# Altium project 飞控.PrjPCB
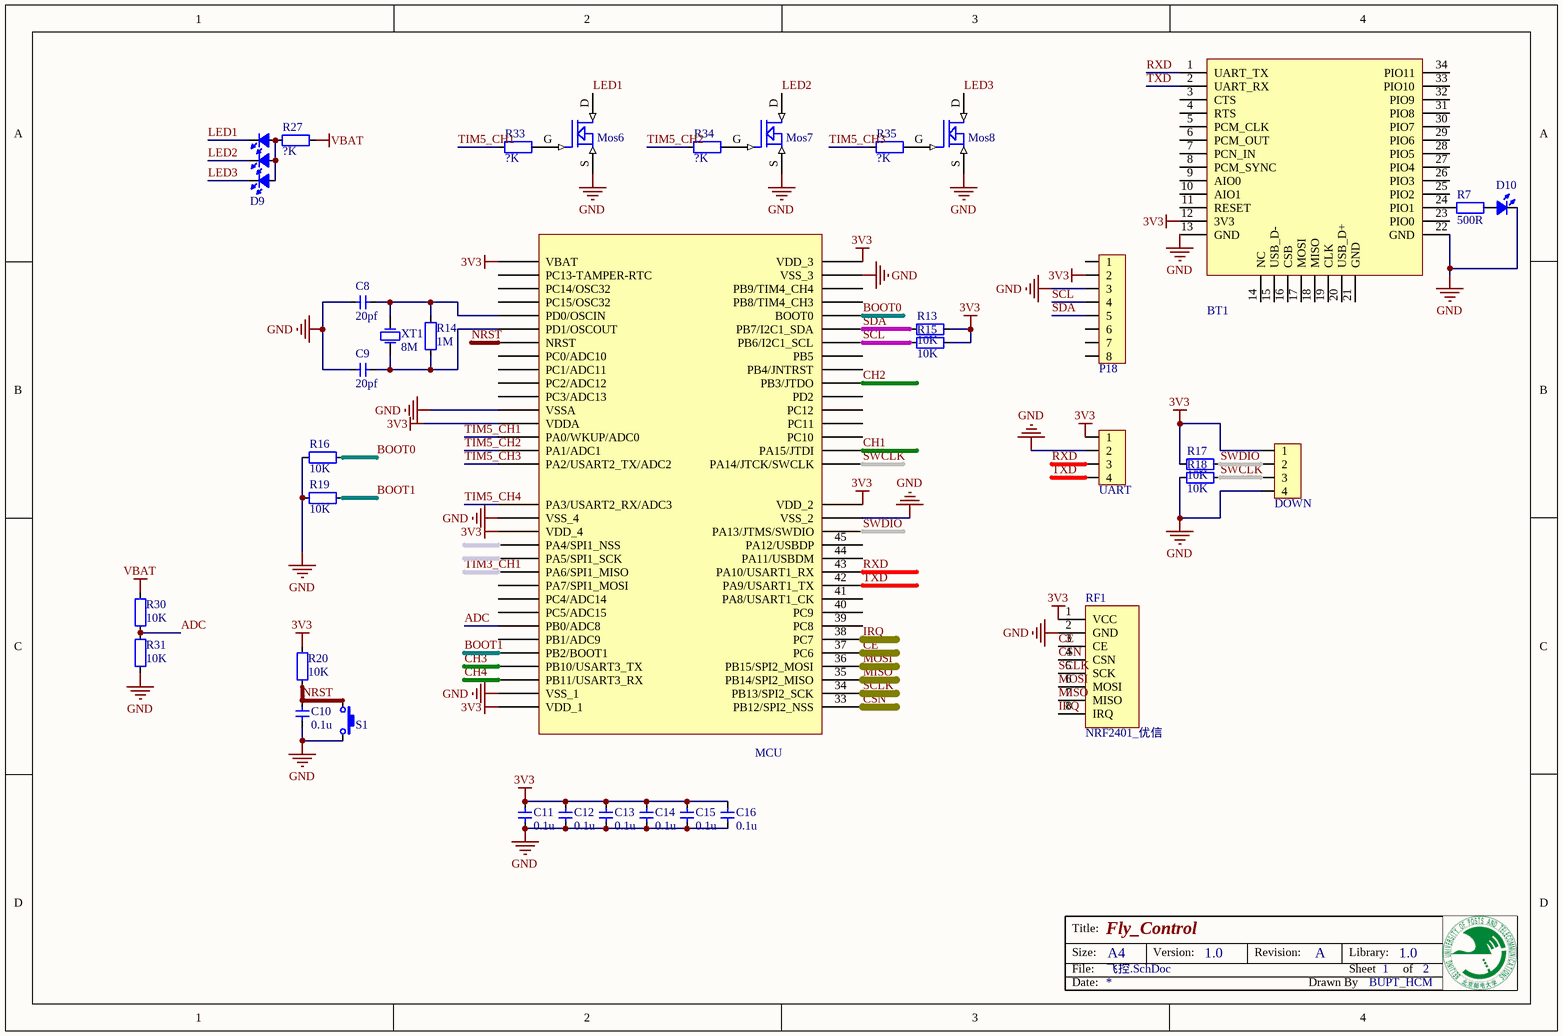
[diagram p0: 飞控.SchDoc]
2 sheets, 90 parts. Net scope: global (net labels, ports and power ports of the same name join across sheets).
Board file: 飞控PCB.PcbDoc
Sheets:
  飞控.SchDoc
  接口.SchDoc

## Sheet 飞控.SchDoc: Fly_Control
size A4; CompanyName: BUPT; DrawnBy: BUPT_HCM; Organization: BUPT_Robot; Revision: A; SheetNumber: 1; SheetTotal: 2; Version: 1.0; LibVersion: 1.0

### Parts
BT1  Bluetooth_HC05  [Bluetooth_HC05]  (value not drawn)
C8  value 20pf  [CAP_0603]  (hidden comment: Cap_0603)
C9  value 20pf  [CAP_0603]  (hidden comment: Cap_0603)
C10  value 0.1u  [CAP_0603]  (hidden comment: Cap_0603)
C11  value 0.1u  [CAP_0603]  (hidden comment: Cap_0603)
C12  value 0.1u  [CAP_0603]  (hidden comment: Cap_0603)
C13  value 0.1u  [CAP_0603]  (hidden comment: Cap_0603)
C14  value 0.1u  [CAP_0603]  (hidden comment: Cap_0603)
C15  value 0.1u  [CAP_0603]  (hidden comment: Cap_0603)
C16  value 0.1u  [CAP_0603]  (hidden comment: Cap_0603)
D9  LED_5050_RGB  [LED_5050_6P]  (value not drawn)
D10  LED_0805  [LED_0805_BLUE]  (value not drawn)
DOWN  HDR1x4_2.54  [HDR1X4_2.54_90]  (value not drawn)
MCU  STM32F103RC  [LQFP_P0.5_64]  (value not drawn)
Mos6  MOSFET N  [Nmos_SOT23]  (value not drawn)
Mos7  MOSFET N  [Nmos_SOT23]  (value not drawn)
Mos8  MOSFET N  [Nmos_SOT23]  (value not drawn)
P18  HDR1x8_2.54  [HDR1X8_2.54_180]  (value not drawn)
R7  value 500R  [RES_0603]  (hidden comment: Res_0603)
R13  value 10K  [RES_0603]  (hidden comment: Res_0603)
R14  value 1M  [RES_0603]  (hidden comment: Res_0603)
R15  value 10K  [RES_0603]  (hidden comment: Res_0603)
R16  value 10K  [RES_0603]  (hidden comment: Res_0603)
R17  value 10K  [RES_0603]  (hidden comment: Res_0603)
R18  value 10K  [RES_0603]  (hidden comment: Res_0603)
R19  value 10K  [RES_0603]  (hidden comment: Res_0603)
R20  value 10K  [RES_0603]  (hidden comment: Res_0603)
R27  value ?K  [RES_0603]  (hidden comment: Res_0603)
R30  value 10K  [RES_0603]  (hidden comment: Res_0603)
R31  value 10K  [RES_0603]  (hidden comment: Res_0603)
R33  value ?K  [RES_0603]  (hidden comment: Res_0603)
R34  value ?K  [RES_0603]  (hidden comment: Res_0603)
R35  value ?K  [RES_0603]  (hidden comment: Res_0603)
RF1  NRF2401_优信  [nrf24l01_youxin]
S1  ButtonTACT_3x4x2_180  [ButtonTACT_3x4x2_180H]  (value not drawn)
UART  HDR1x4_2.54  [HDR1x4_2.54_180]  (value not drawn)
XT1  value 8M  [XT_5032_2]  (hidden comment: XTAL_5032_2P)

### Nets
3V3: BT1.12(3V3) C11.2 C12.2 C13.2 C14.2 C15.2 C16.2 DOWN.1 MCU.1(VBAT) MCU.13(VDDA) MCU.19(VDD_4) MCU.32(VDD_1) MCU.48(VDD_2) MCU.64(VDD_3) P18.2 R13.2 R15.2 R17.2 R20.1 RF1.1(VCC) UART.1
GND: BT1.13(GND) BT1.22(GND) C8.1 C9.1 C10.1 C11.1 C12.1 C13.1 C14.1 C15.1 C16.1 D10.2(K) DOWN.4 MCU.12(VSSA) MCU.18(VSS_4) MCU.31(VSS_1) MCU.47(VSS_2) MCU.63(VSS_3) Mos6.S Mos7.S Mos8.S P18.3 R16.2 R18.2 R19.2 R31.1 RF1.2(GND) S1.2 UART.2
VBAT: R27.1 R30.2
ADC: MCU.26(PB0/ADC8) R30.1 R31.2
BOOT0: MCU.60(BOOT0) R16.1
BOOT1: MCU.28(PB2/BOOT1) R19.1
CE: MCU.37(PC6) RF1.3(CE)
CH1: MCU.50(PA15/JTDI)
CH2: MCU.55(PB3/JTDO)
CH3: MCU.29(PB10/USART3_TX)
CH4: MCU.30(PB11/USART3_RX)
CSN: MCU.33(PB12/SPI2_NSS) RF1.4(CSN)
IRQ: MCU.38(PC7) RF1.8(IRQ)
LED1: D9.3(K) Mos6.D
LED2: D9.2(K) Mos7.D
LED3: D9.1(K) Mos8.D
MISO: MCU.35(PB14/SPI2_MISO) RF1.7(MISO)
MOSI: MCU.36(PB15/SPI2_MOSI) RF1.6(MOSI)
NRST: C10.2 MCU.7(NRST) R20.2 S1.1
RXD: BT1.1(UART_TX) MCU.43(PA10/USART1_RX) UART.3
SCL: MCU.58(PB6/I2C1_SCL) P18.4 R15.1
SCLK: MCU.34(PB13/SPI2_SCK) RF1.5(SCK)
SDA: MCU.59(PB7/I2C1_SDA) P18.5 R13.1
SWCLK: DOWN.3 MCU.49(PA14/JTCK/SWCLK) R18.1
SWDIO: DOWN.2 MCU.46(PA13/JTMS/SWDIO) R17.1
TIM3_CH1: MCU.22(PA6/SPI1_MISO)
TIM5_CH1: MCU.14(PA0/WKUP/ADC0) R33.1
TIM5_CH2: MCU.15(PA1/ADC1) R34.1
TIM5_CH3: MCU.16(PA2/USART2_TX/ADC2) R35.1
TIM5_CH4: MCU.17(PA3/USART2_RX/ADC3)
TXD: BT1.2(UART_RX) MCU.42(PA9/USART1_TX) UART.4
NetBT1_24: BT1.24(PIO1) R7.1
NetC8_2: C8.2 MCU.5(PD0/OSCIN) R14.2 XT1.2(OSC2)
NetC9_2: C9.2 MCU.6(PD1/OSCOUT) R14.1 XT1.1(OSC1)
NetD9_4: D9.4(A) D9.5(A) D9.6(A) R27.2
NetD10_1: D10.1(A) R7.2
NetMos6_G: Mos6.G R33.2
NetMos7_G: Mos7.G R34.2
NetMos8_G: Mos8.G R35.2

Not connected (* = marked no-connect by the designer): BT1 3(CTS) 4(RTS) 5(PCM_CLK) 6(PCM_OUT) 7(PCN_IN) 8(PCM_SYNC) 9(AIO0) 10(AIO1) 11(RESET) 14(NC) 15(USB_D-) 16(CSB) 17(MOSI) 18(MISO) 19(CLK) 20(USB_D+) 21(GND) 23(PIO0) 25(PIO2) 26(PIO3) 27(PIO4) 28(PIO5) 29(PIO6) 30(PIO7) 31(PIO8) 32(PIO9) 33(PIO10) 34(PIO11); MCU 2(PC13-TAMPER-RTC) 3(PC14/OSC32) 4(PC15/OSC32) 8(PC0/ADC10) 9(PC1/ADC11) 10(PC2/ADC12) 11(PC3/ADC13) 20(PA4/SPI1_NSS) 21(PA5/SPI1_SCK) 23(PA7/SPI1_MOSI) 24(PC4/ADC14) 25(PC5/ADC15) 27(PB1/ADC9) 39(PC8) 40(PC9) 41(PA8/USART1_CK) 44(PA11/USBDM) 45(PA12/USBDP) 51(PC10) 52(PC11) 53(PC12) 54(PD2) 56(PB4/JNTRST) 57(PB5) 61(PB8/TIM4_CH3) 62(PB9/TIM4_CH4); P18 1 6 7 8

### Notes on the sheet
- Title:
- Size:
- Date:
- File:
- A4
- Version:
- Revision:
- Drawn By
- Sheet
- Library:
- of

### Library data of the parts
BT1 = Bluetooth_HC05: Module
C8-C16 = Cap_0603: Capacitor
D9 = LED_5050_RGB: LED
D10 = LED_0805: LED
DOWN UART = HDR1x4_2.54: Header
MCU = STM32F103RC: MCU
Mos6-Mos8 = MOSFET N: MOS SOT23
P18 = HDR1x8_2.54: Header
R7 R13-R20 R27 R30 R31 R33-R35 = Res_0603: Resistor
S1 = ButtonTACT_3x4x2_180: Button
XT1 = XTAL_5032_2P: Crystal Oscillator

## Sheet 接口.SchDoc: Template
size A4; CompanyName: BUPT; DrawnBy: BUPT_HCM; Organization: BUPT_Robot; Revision: A; SheetNumber: 1; SheetTotal: 1; Version: 0.0; LibVersion: 0.0
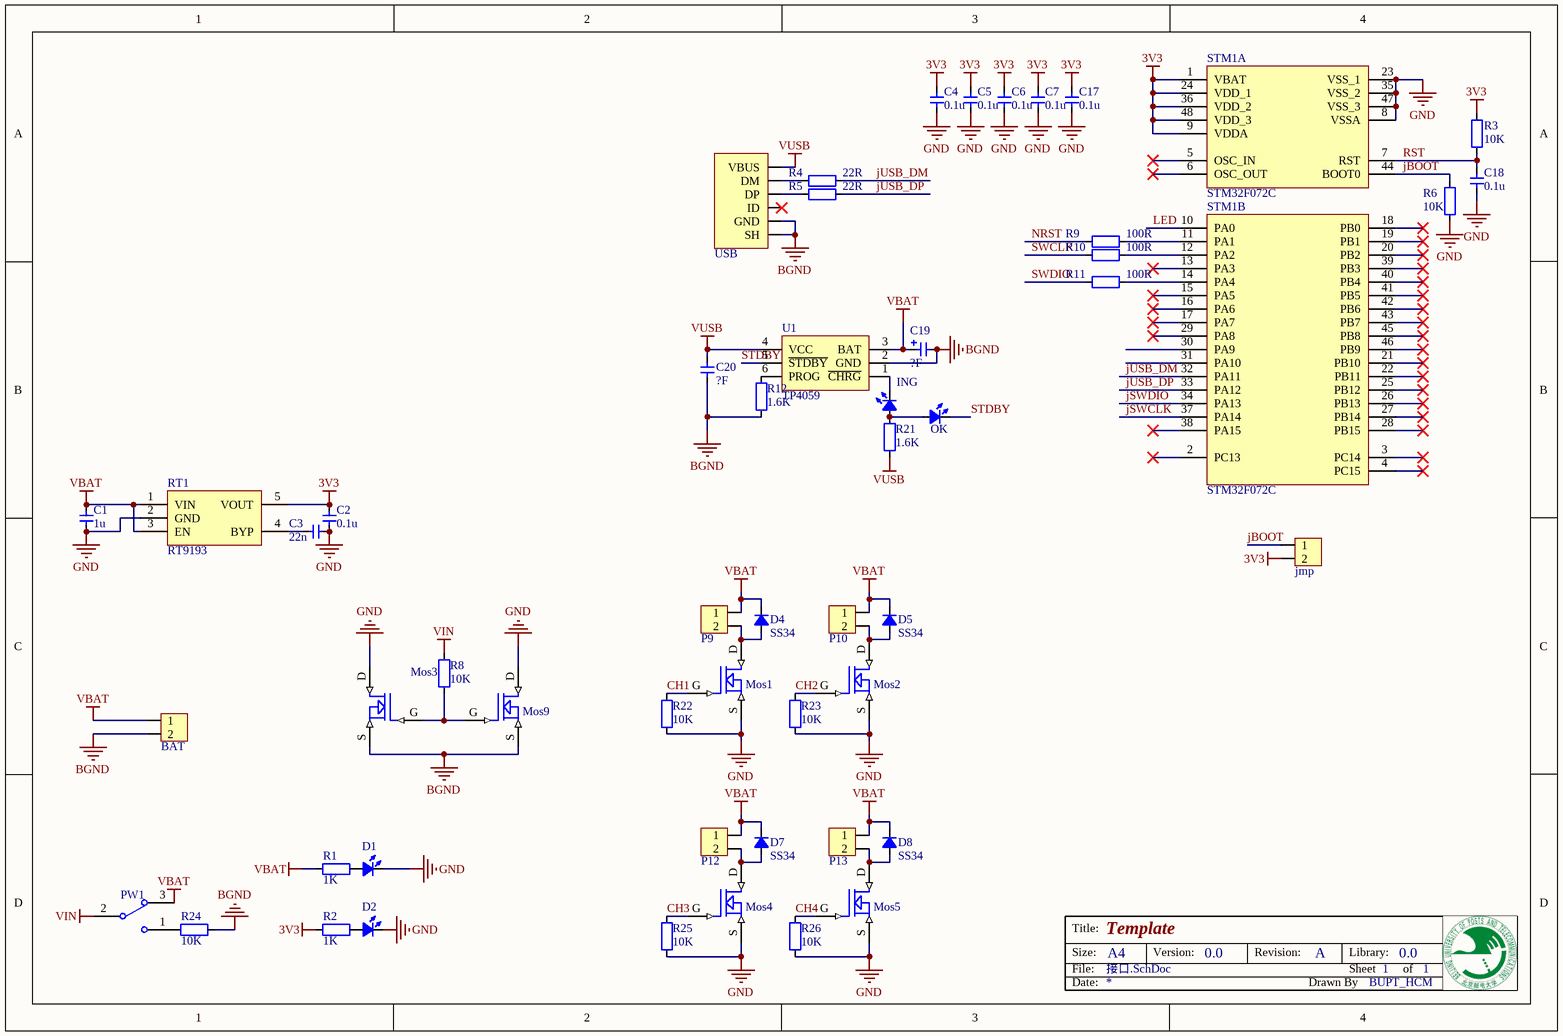
[diagram p1: 接口.SchDoc]

### Parts
BAT  HDR1x2_2.54  [HDR1X2_2.54_90]  (value not drawn)
C1  value 1u  [CAP_0603]  (hidden comment: Cap_0603)
C2  value 0.1u  [CAP_0603]  (hidden comment: Cap_0603)
C3  value 22n  [CAP_0603]  (hidden comment: Cap_0603)
C4  value 0.1u  [CAP_0603]  (hidden comment: Cap_0603)
C5  value 0.1u  [CAP_0603]  (hidden comment: Cap_0603)
C6  value 0.1u  [CAP_0603]  (hidden comment: Cap_0603)
C7  value 0.1u  [CAP_0603]  (hidden comment: Cap_0603)
C17  value 0.1u  [CAP_0603]  (hidden comment: Cap_0603)
C18  value 0.1u  [CAP_0603]  (hidden comment: Cap_0603)
C19  value ?F  [CAP_TAN_D2917]  (hidden comment: Cap_Tan_2917)
C20  value ?F  [CAP_0805]  (hidden comment: Cap_0805)
D1  LED_0805  [LED_0805_YELLOW]  (value not drawn)
D2  LED_0805  [LED_0805_YELLOW]  (value not drawn)
D4  value SS34  [DO-214AC]  (hidden comment: Diode_SMA)
D5  value SS34  [DO-214AC]  (hidden comment: Diode_SMA)
D7  value SS34  [DO-214AC]  (hidden comment: Diode_SMA)
D8  value SS34  [DO-214AC]  (hidden comment: Diode_SMA)
ING  LED_0805  [LED_0805_RED]  (value not drawn)
jmp  HDR1x2_2.54  [HDR1X2_2.54_180]  (value not drawn)
Mos1  MOSFET N  [Nmos_SOT23]  (value not drawn)
Mos2  MOSFET N  [Nmos_SOT23]  (value not drawn)
Mos3  MOSFET N  [Nmos_SOT23]  (value not drawn)
Mos4  MOSFET N  [Nmos_SOT23]  (value not drawn)
Mos5  MOSFET N  [Nmos_SOT23]  (value not drawn)
Mos9  MOSFET N  [Nmos_SOT23]  (value not drawn)
OK  LED_0805  [LED_0805_GREEN]  (value not drawn)
P9  HDR1x2_2.54  [HDR1X2_2.54_180]  (value not drawn)
P10  HDR1x2_2.54  [HDR1X2_2.54_180]  (value not drawn)
P12  HDR1x2_2.54  [HDR1X2_2.54_180]  (value not drawn)
P13  HDR1x2_2.54  [HDR1X2_2.54_180]  (value not drawn)
PW1  SwitchSPDT_2.8x6.6_90  [SwitchSPDT_2.8X6.6_90]  (value not drawn)
R1  value 1K  [RES_0603]  (hidden comment: Res_0603)
R2  value 1K  [RES_0603]  (hidden comment: Res_0603)
R3  value 10K  [RES_0603]  (hidden comment: Res_0603)
R4  value 22R  [RES_0603]  (hidden comment: Res_0603)
R5  value 22R  [RES_0603]  (hidden comment: Res_0603)
R6  value 10K  [RES_0603]  (hidden comment: Res_0603)
R8  value 10K  [RES_0603]  (hidden comment: Res_0603)
R9  value 100R  [RES_0603]  (hidden comment: Res_0603)
R10  value 100R  [RES_0603]  (hidden comment: Res_0603)
R11  value 100R  [RES_0603]  (hidden comment: Res_0603)
R12  value 1.6K  [RES_0603]  (hidden comment: Res_0603)
R21  value 1.6K  [RES_0603]  (hidden comment: Res_0603)
R22  value 10K  [RES_0603]  (hidden comment: Res_0603)
R23  value 10K  [RES_0603]  (hidden comment: Res_0603)
R24  value 10K  [RES_0603]  (hidden comment: Res_0603)
R25  value 10K  [RES_0603]  (hidden comment: Res_0603)
R26  value 10K  [RES_0603]  (hidden comment: Res_0603)
RT1  RT9193  [SOT23-5]
STM1  STM32F072C  [LQFP_P0.5_48]  (parts A,B of 2)
U1  TP4059  [SOT23-6]
USB  USB_Micro  [USB_Micro-AB]  (value not drawn)

### Nets
3V3: C2.2 C4.1 C5.1 C6.1 C7.1 C17.2 jmp.2 R2.1 R3.2 RT1.5(VOUT) STM1.1(VBAT) STM1.9(VDDA) STM1.24(VDD_1) STM1.36(VDD_2) STM1.48(VDD_3)
BGND: BAT.2 C19.2 C20.1 Mos3.S Mos9.S R12.2 R24.2 U1.2(GND) USB.0(SH) USB.5(GND)
GND: C1.1 C2.1 C3.1 C4.2 C5.2 C6.2 C7.2 C17.1 C18.1 D1.2(K) D2.2(K) Mos1.S Mos2.S Mos3.D Mos4.S Mos5.S Mos9.D R6.1 R22.1 R23.1 R25.1 R26.1 RT1.2(GND) STM1.8(VSSA) STM1.23(VSS_1) STM1.35(VSS_2) STM1.47(VSS_3)
VBAT: BAT.1 C1.2 C19.1 D4.2(K) D5.2(K) D7.2(K) D8.2(K) P9.1 P10.1 P12.1 P13.1 PW1.3 R1.1 RT1.1(VIN) RT1.3(EN) U1.3(BAT)
VIN: PW1.2 R8.2
VUSB: C20.2 R21.2 U1.4(VCC) USB.1(VBUS)
CH1: Mos1.G R22.2
CH2: Mos2.G R23.2
CH3: Mos4.G R25.2
CH4: Mos5.G R26.2
jBOOT: jmp.1 R6.2 STM1.44(BOOT0)
jSWCLK: STM1.37(PA14)
jSWDIO: STM1.34(PA13)
jUSB_DM: R4.2 STM1.32(PA11)
jUSB_DP: R5.2 STM1.33(PA12)
LED: STM1.10(PA0)
NRST: R9.1
RST: C18.2 R3.1 STM1.7(RST)
STDBY: OK.2(K) U1.5(~{STDBY})
SWCLK: R10.1
SWDIO: R11.1
NetC3_2: C3.2 RT1.4(BYP)
NetD1_1: D1.1(A) R1.2
NetD2_1: D2.1(A) R2.2
NetD4_1: D4.1(A) Mos1.D P9.2
NetD5_1: D5.1(A) Mos2.D P10.2
NetD7_1: D7.1(A) Mos4.D P12.2
NetD8_1: D8.1(A) Mos5.D P13.2
NetING_1: ING.1(A) OK.1(A) R21.1
NetING_2: ING.2(K) U1.1(~{CHRG})
NetMos3_G: Mos3.G Mos9.G R8.1
NetPW1_1: PW1.1 R24.1
NetR4_1: R4.1 USB.2(DM)
NetR5_1: R5.1 USB.3(DP)
NetR9_2: R9.2 STM1.11(PA1)
NetR10_2: R10.2 STM1.12(PA2)
NetR11_2: R11.2 STM1.14(PA4)
NetR12_1: R12.1 U1.6(PROG)

Not connected (* = marked no-connect by the designer): STM1 2(PC13)* 3(PC14)* 4(PC15)* 5(OSC_IN)* 6(OSC_OUT)* 13(PA3)* 15(PA5)* 16(PA6)* 17(PA7)* 18(PB0)* 19(PB1)* 20(PB2)* 21(PB10)* 22(PB11)* 25(PB12)* 26(PB13)* 27(PB14)* 28(PB15)* 29(PA8)* 30(PA9) 31(PA10) 38(PA15)* 39(PB3)* 40(PB4)* 41(PB5)* 42(PB6)* 43(PB7)* 45(PB8)* 46(PB9)*; USB 4(ID)*

### Notes on the sheet
- Title:
- Size:
- Date:
- File:
- A4
- Version:
- Revision:
- Drawn By
- Sheet
- Library:
- of

### Library data of the parts
BAT jmp = HDR1x2_2.54: Header
C1-C7 C17 C18 = Cap_0603: Capacitor
C19 = Cap_Tan_2917: Capacitor
C20 = Cap_0805: Capacitor
D1 D2 ING OK = LED_0805: LED
D4 D5 D7 D8 = Diode_SMA: Diode
Mos1-Mos5 Mos9 = MOSFET N: MOS SOT23
P9 P10 P12 P13 = HDR1x2_2.54T: Header
PW1 = SwitchSPDT_2.8x6.6_90: Switch
R1-R6 R8-R12 R21-R26 = Res_0603: Resistor
RT1 = RT9193: Power
STM1 = STM32F103C: MCU
USB = USB_Micro: USB

## Nets that join several sheets
3V3: 飞控 (21 pins), 接口 (15 pins)
GND: 飞控 (29 pins), 接口 (27 pins)
VBAT: 飞控 (R27.1 R30.2), 接口 (16 pins)
CH1: 飞控 (MCU.50), 接口 (Mos1.G R22.2)
CH2: 飞控 (MCU.55), 接口 (Mos2.G R23.2)
CH3: 飞控 (MCU.29), 接口 (Mos4.G R25.2)
CH4: 飞控 (MCU.30), 接口 (Mos5.G R26.2)
NRST: 飞控 (C10.2 MCU.7 R20.2 S1.1), 接口 (R9.1)
SWCLK: 飞控 (DOWN.3 MCU.49 R18.1), 接口 (R10.1)
SWDIO: 飞控 (DOWN.2 MCU.46 R17.1), 接口 (R11.1)